# Altium schematic sheet Controller_Board_Interface.SchDoc
size Letter; Website: www.uwmidsun.com
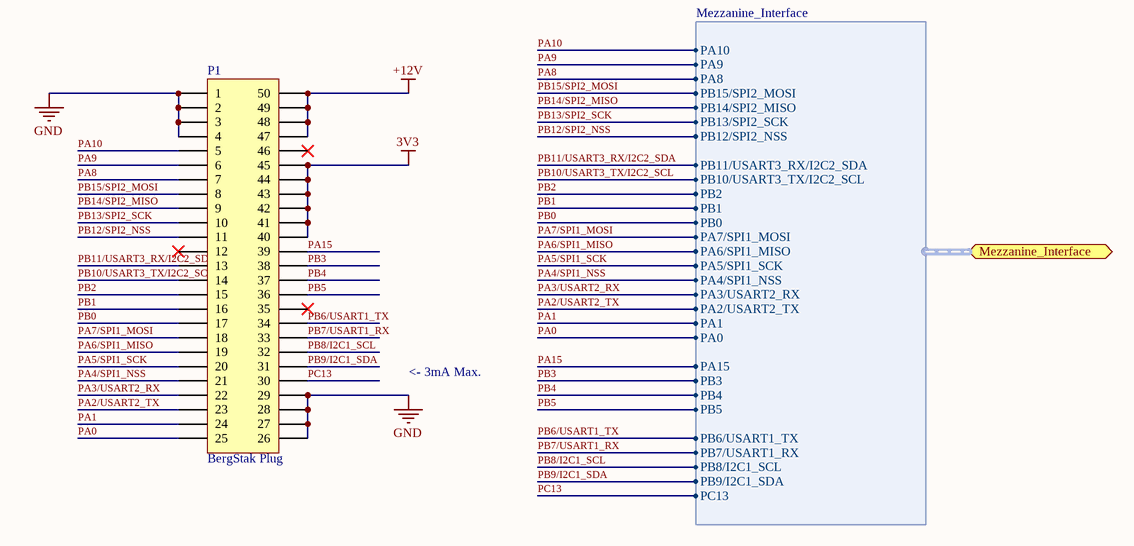
[diagram p0: Controller_Board_Interface.SchDoc]

## Parts
P1  Series: BergStak Plug  [CONN, Bergstak 50 Pos Plug]  (hidden comment: CONN 50POS Bergstak Plug 0.02")

## Ports
Mezzanine_Interface (harness Mezzanine_Interface)

## Harnesses
Mezzanine_Interface: PA10, PA9, PA8, PB15/SPI2_MOSI, PB14/SPI2_MISO, PB13/SPI2_SCK, PB12/SPI2_NSS, PB11/USART3_RX/I2C2_SDA, PB10/USART3_TX/I2C2_SCL, PB2, PB1, PB0, PA7/SPI1_MOSI, PA6/SPI1_MISO, PA5/SPI1_SCK, PA4/SPI1_NSS, PA3/USART2_RX, PA2/USART2_TX, PA1, PA0, PA15, PB3, PB4, PB5, PB6/USART1_TX, PB7/USART1_RX, PB8/I2C1_SCL, PB9/I2C1_SDA, PC13

## Nets
3V3: P1.40 P1.41 P1.42 P1.43 P1.44 P1.45
+12V: P1.47 P1.48 P1.49 P1.50
GND: P1.1 P1.2 P1.3 P1.4 P1.26 P1.27 P1.28 P1.29
PA0: P1.25 ; port Mezzanine_Interface.PA0
PA1: P1.24 ; port Mezzanine_Interface.PA1
PA2/USART2_TX: P1.23 ; port Mezzanine_Interface.PA2/USART2_TX
PA3/USART2_RX: P1.22 ; port Mezzanine_Interface.PA3/USART2_RX
PA4/SPI1_NSS: P1.21 ; port Mezzanine_Interface.PA4/SPI1_NSS
PA5/SPI1_SCK: P1.20 ; port Mezzanine_Interface.PA5/SPI1_SCK
PA6/SPI1_MISO: P1.19 ; port Mezzanine_Interface.PA6/SPI1_MISO
PA7/SPI1_MOSI: P1.18 ; port Mezzanine_Interface.PA7/SPI1_MOSI
PA8: P1.7 ; port Mezzanine_Interface.PA8
PA9: P1.6 ; port Mezzanine_Interface.PA9
PA10: P1.5 ; port Mezzanine_Interface.PA10
PA15: P1.39 ; port Mezzanine_Interface.PA15
PB0: P1.17 ; port Mezzanine_Interface.PB0
PB1: P1.16 ; port Mezzanine_Interface.PB1
PB2: P1.15 ; port Mezzanine_Interface.PB2
PB3: P1.38 ; port Mezzanine_Interface.PB3
PB4: P1.37 ; port Mezzanine_Interface.PB4
PB5: P1.36 ; port Mezzanine_Interface.PB5
PB6/USART1_TX: P1.34 ; port Mezzanine_Interface.PB6/USART1_TX
PB7/USART1_RX: P1.33 ; port Mezzanine_Interface.PB7/USART1_RX
PB8/I2C1_SCL: P1.32 ; port Mezzanine_Interface.PB8/I2C1_SCL
PB9/I2C1_SDA: P1.31 ; port Mezzanine_Interface.PB9/I2C1_SDA
PB10/USART3_TX/I2C2_SCL: P1.14 ; port Mezzanine_Interface.PB10/USART3_TX/I2C2_SCL
PB11/USART3_RX/I2C2_SDA: P1.13 ; port Mezzanine_Interface.PB11/USART3_RX/I2C2_SDA
PB12/SPI2_NSS: P1.11 ; port Mezzanine_Interface.PB12/SPI2_NSS
PB13/SPI2_SCK: P1.10 ; port Mezzanine_Interface.PB13/SPI2_SCK
PB14/SPI2_MISO: P1.9 ; port Mezzanine_Interface.PB14/SPI2_MISO
PB15/SPI2_MOSI: P1.8 ; port Mezzanine_Interface.PB15/SPI2_MOSI
PC13: P1.30 ; port Mezzanine_Interface.PC13

Not connected (* = marked no-connect by the designer): P1 12* 35* 46*

## Notes on the sheet
- <- 3mA Max.
- Project:
- Title:
- Size:
- Project Lead:
- Letter
- Revision:
- University of Waterloo
- 200 University Ave W
- Waterloo, ON, Canada
- N2L 3E9
- Date:
- Sheet
- of
- Website:

## Library data of the parts
P1 = CONN 50POS Bergstak Plug 0.02": 50 Position Connector Plug, Outer Shroud Contacts Surface Mount Gold; Manufacturer 1: Amphenol FCI; Manufacturer Part Number 1: 10132797-055100LF; Number of Positions: 50; Mated Stacking Heights: 5mm; Pitch: 0.020" (0.50mm); Supplier 1: Digi-Key; Supplier Part Number 1: 609-5226-1-ND; Packaging: Cut Tape (CT); Part Status: Active; Connector Type: Plug, Outer Shroud Contacts; Number of Rows: 2; Mounting Type: Surface Mount; Contact Finish: Gold; Contact Finish Thickness: 1µin (0.025µm); Height Above Board: 0.169" (4.30mm); ComponentLink1URL: http://portal.fciconnect.com/Comergent//fci/drawing/10132797.pdf; ComponentLink1Description: http://portal.fciconnect.com/Comergent//fci/drawing/10132797.pdf